# Altium schematic sheet SysBlock.SchDoc
size 220 x 165 mm
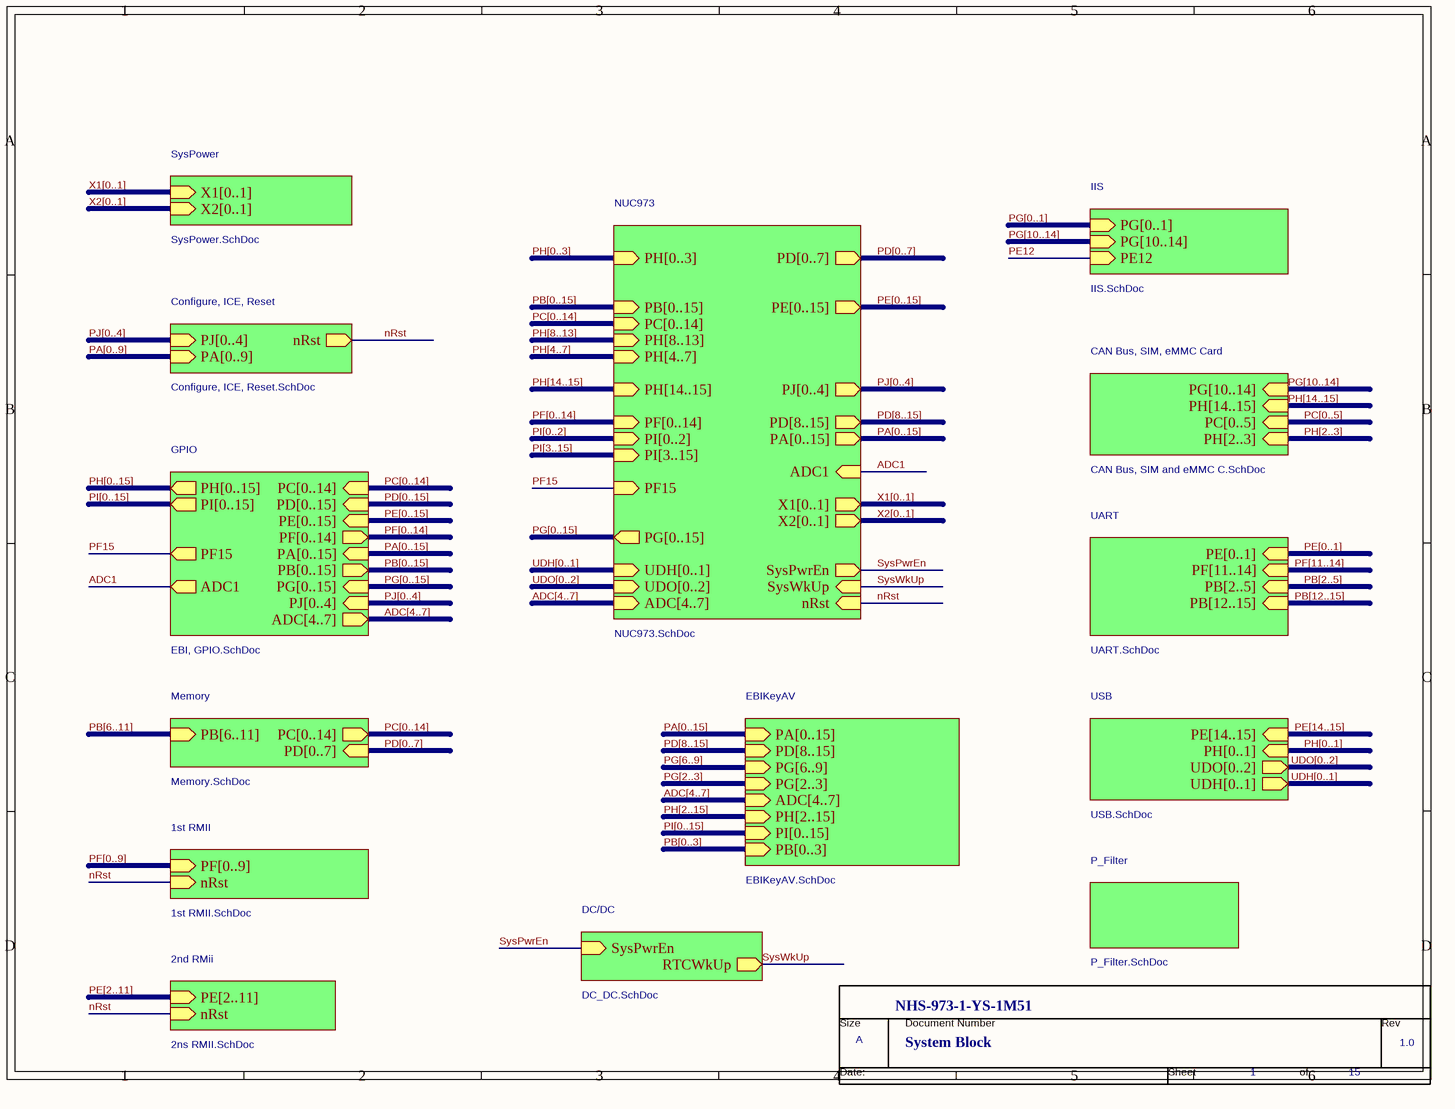
[diagram p0: SysBlock.SchDoc]

## Parts
*  RevCode: 1.0  Page Size: A  Page Number: 1  Page Count: 15  Doc: System Block  OrgName: NHS-973-1-YS-1M51  (hidden comment: TitleBlock0N)  (graphical)

## Sub-sheets
1st RMII = 1st RMII.SchDoc: PF[0..9] (in), nRst (in)
2nd RMii = 2ns RMII.SchDoc: PE[2..11] (in), nRst (in)
CAN Bus, SIM, eMMC Card = CAN Bus, SIM and eMMC C.SchDoc: PG[10..14] (in), PH[14..15] (in), PH[2..3] (in), PC[0..5] (in)
Configure, ICE, Reset = Configure, ICE, Reset.SchDoc: PJ[0..4] (in), nRst (out), PA[0..9] (in)
DC/DC = DC_DC.SchDoc: SysPwrEn (in), RTCWkUp (out)
EBIKeyAV = EBIKeyAV.SchDoc: PA[0..15] (in), PD[8..15] (in), PG[6..9] (in), PG[2..3] (in), ADC[4..7] (in), PH[2..15] (in), PI[0..15] (in), PB[0..3] (in)
GPIO = EBI, GPIO.SchDoc: PC[0..14] (in), PD[0..15] (in), PE[0..15] (in), PF[0..14] (out), PH[0..15] (out), PA[0..15] (in), PB[0..15] (out), PG[0..15] (in), PI[0..15] (out), PJ[0..4] (in), ADC[4..7] (out), PF15 (out), ADC1 (out)
IIS = IIS.SchDoc: PG[0..1] (in), PG[10..14] (in), PE12 (in)
Memory = Memory.SchDoc: PB[6..11] (in), PC[0..14] (out), PD[0..7] (in)
NUC973 = NUC973.SchDoc: PD[0..7] (out), PH[0..3] (in), PE[0..15] (out), X1[0..1] (out), PB[0..15] (in), PC[0..14] (in), PH[8..13] (in), PH[4..7] (in), UDH[0..1] (in), PH[14..15] (in), UDO[0..2] (in), X2[0..1] (out), PF[0..14] (in), PI[0..2] (in), PI[3..15] (in), PJ[0..4] (out), nRst (in), PG[0..15] (out), PD[8..15] (out), PA[0..15] (out), SysWkUp (in), SysPwrEn (out), ADC[4..7] (in), PF15 (in), ADC1 (in)
P_Filter = P_Filter.SchDoc: no entries
SysPower = SysPower.SchDoc: X1[0..1] (in), X2[0..1] (in)
UART = UART.SchDoc: PE[0..1] (in), PF[11..14] (in), PB[2..5] (in), PB[12..15] (in)
USB = USB.SchDoc: PE[14..15] (in), UDO[0..2] (out), UDH[0..1] (out), PH[0..1] (in)

## Nets
ADC1: sheet NUC973/ADC1, sheet GPIO/ADC1
nRst: sheet 2nd RMii/nRst, sheet Configure, ICE, Reset/nRst, sheet NUC973/nRst, sheet 1st RMII/nRst
PE12: sheet IIS/PE12
PF15: sheet NUC973/PF15, sheet GPIO/PF15
SysPwrEn: sheet DC/DC/SysPwrEn, sheet NUC973/SysPwrEn
SysWkUp: sheet DC/DC/RTCWkUp, sheet NUC973/SysWkUp

## Buses and harness runs
bus ADC[4..7] = sheet EBIKeyAV/ADC[4..7]
bus ADC[4..7] = sheet GPIO/ADC[4..7]
bus ADC[4..7] = sheet NUC973/ADC[4..7]
bus PA[0..9] = sheet Configure, ICE, Reset/PA[0..9]
bus PA[0..15] = sheet EBIKeyAV/PA[0..15]
bus PA[0..15] = sheet GPIO/PA[0..15]
bus PA[0..15] = sheet NUC973/PA[0..15]
bus PB[0..3] = sheet EBIKeyAV/PB[0..3]
bus PB[0..15] = sheet GPIO/PB[0..15]
bus PB[0..15] = sheet NUC973/PB[0..15]
bus PB[2..5] = sheet UART/PB[2..5]
bus PB[6..11] = sheet Memory/PB[6..11]
bus PB[12..15] = sheet UART/PB[12..15]
bus PC[0..5] = sheet CAN Bus, SIM, eMMC Card/PC[0..5]
bus PC[0..14] = sheet GPIO/PC[0..14]
bus PC[0..14] = sheet Memory/PC[0..14]
bus PC[0..14] = sheet NUC973/PC[0..14]
bus PD[0..7] = sheet Memory/PD[0..7]
bus PD[0..7] = sheet NUC973/PD[0..7]
bus PD[0..15] = sheet GPIO/PD[0..15]
bus PD[8..15] = sheet EBIKeyAV/PD[8..15]
bus PD[8..15] = sheet NUC973/PD[8..15]
bus PE[0..1] = sheet UART/PE[0..1]
bus PE[0..15] = sheet GPIO/PE[0..15]
bus PE[0..15] = sheet NUC973/PE[0..15]
bus PE[2..11] = sheet 2nd RMii/PE[2..11]
bus PE[14..15] = sheet USB/PE[14..15]
bus PF[0..9] = sheet 1st RMII/PF[0..9]
bus PF[0..14] = sheet GPIO/PF[0..14]
bus PF[0..14] = sheet NUC973/PF[0..14]
bus PF[11..14] = sheet UART/PF[11..14]
bus PG[0..1] = sheet IIS/PG[0..1]
bus PG[0..15] = sheet GPIO/PG[0..15]
bus PG[0..15] = sheet NUC973/PG[0..15]
bus PG[2..3] = sheet EBIKeyAV/PG[2..3]
bus PG[6..9] = sheet EBIKeyAV/PG[6..9]
bus PG[10..14] = sheet CAN Bus, SIM, eMMC Card/PG[10..14]
bus PG[10..14] = sheet IIS/PG[10..14]
bus PH[0..1] = sheet USB/PH[0..1]
bus PH[0..3] = sheet NUC973/PH[0..3]
bus PH[0..15] = sheet GPIO/PH[0..15]
bus PH[2..3] = sheet CAN Bus, SIM, eMMC Card/PH[2..3]
bus PH[2..15] = sheet EBIKeyAV/PH[2..15]
bus PH[4..7] = sheet NUC973/PH[4..7]
bus PH[8..13] = sheet NUC973/PH[8..13]
bus PH[14..15] = sheet CAN Bus, SIM, eMMC Card/PH[14..15]
bus PH[14..15] = sheet NUC973/PH[14..15]
bus PI[0..2] = sheet NUC973/PI[0..2]
bus PI[0..15] = sheet EBIKeyAV/PI[0..15]
bus PI[0..15] = sheet GPIO/PI[0..15]
bus PI[3..15] = sheet NUC973/PI[3..15]
bus PJ[0..4] = sheet Configure, ICE, Reset/PJ[0..4]
bus PJ[0..4] = sheet GPIO/PJ[0..4]
bus PJ[0..4] = sheet NUC973/PJ[0..4]
bus UDH[0..1] = sheet NUC973/UDH[0..1]
bus UDH[0..1] = sheet USB/UDH[0..1]
bus UDO[0..2] = sheet NUC973/UDO[0..2]
bus UDO[0..2] = sheet USB/UDO[0..2]
bus X1[0..1] = sheet NUC973/X1[0..1]
bus X1[0..1] = sheet SysPower/X1[0..1]
bus X2[0..1] = sheet NUC973/X2[0..1]
bus X2[0..1] = sheet SysPower/X2[0..1]

## Notes on the sheet
- (in symbol TitleBlock0N) Size; Document Number; Rev; Date:; Sheet; of

## Library data of the parts
* = TitleBlock0N: Page Create Date: April 25, 1995